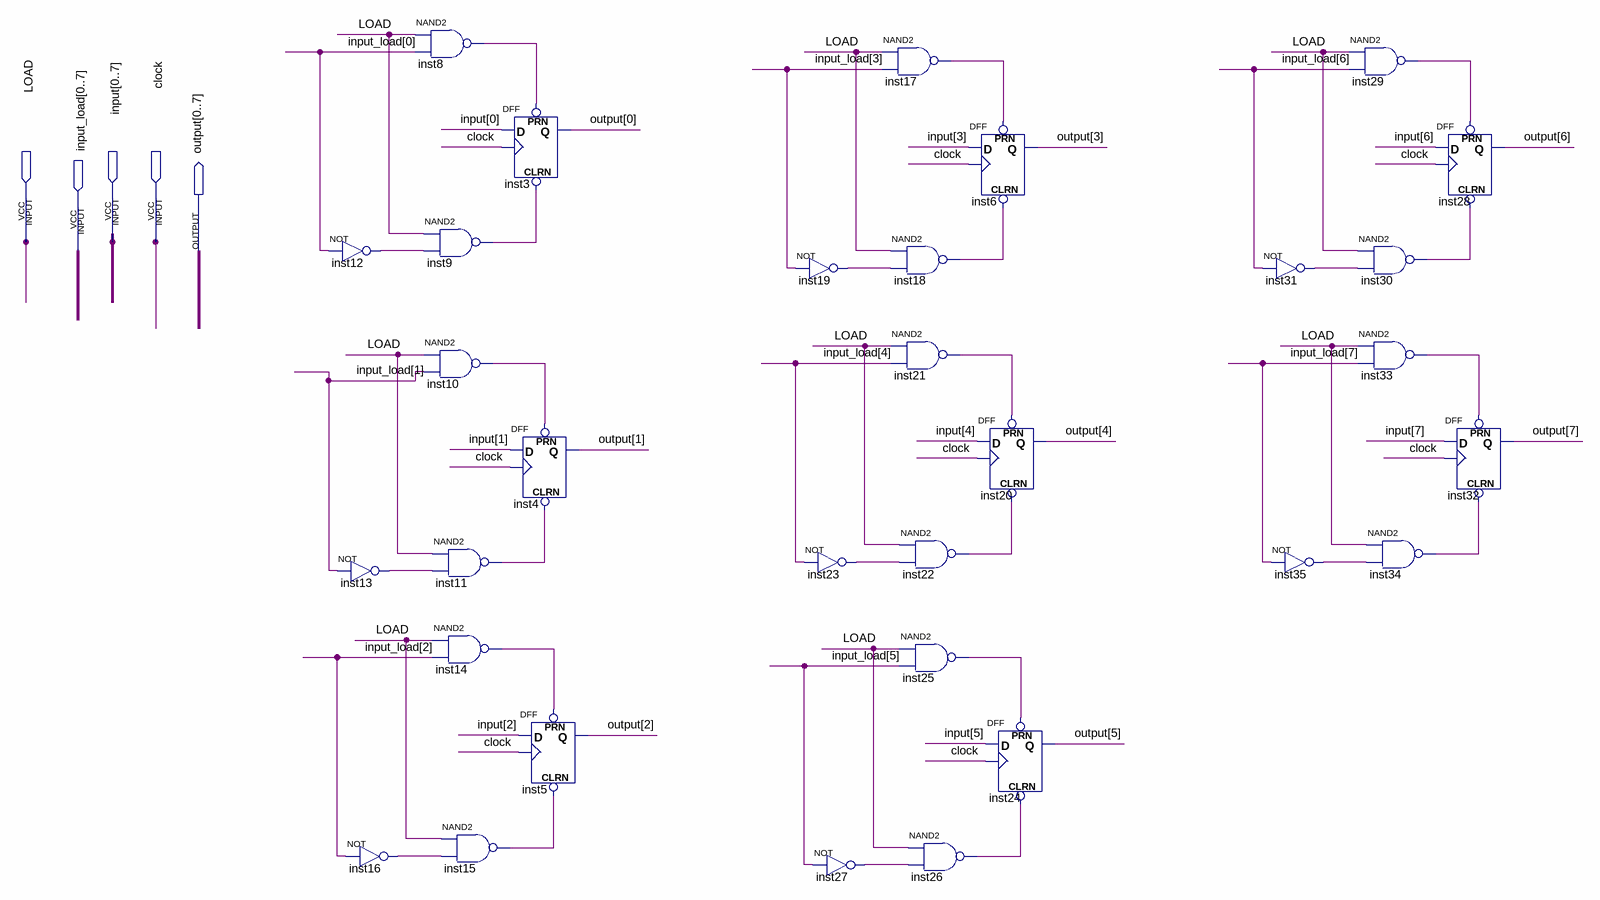
[diagram p0: schematic sheet]
// Quartus schematic REGISTER_8BIT.bdf as structural Verilog: 32 symbols, 5 pins
module REGISTER_8BIT (
  input  LOAD,
  input  [0:7] \input ,
  input  clock,
  input  [0:7] input_load,
  output [0:7] \output 
);

  wire inst8_out, inst9_out, inst10_out, inst11_out, inst12_out, inst13_out, inst14_out, inst15_out,
       inst16_out, inst17_out, inst18_out, inst19_out, inst21_out, inst22_out, inst23_out, inst25_out,
       inst26_out, inst27_out, inst29_out, inst30_out, inst31_out, inst33_out, inst34_out, inst35_out;

  not inst12 (inst12_out, input_load[0]);
  not inst13 (inst13_out, input_load[1]);
  not inst16 (inst16_out, input_load[2]);
  nand inst8 (inst8_out, LOAD, input_load[0]);
  nand inst9 (inst9_out, LOAD, inst12_out);
  nand inst10 (inst10_out, LOAD, input_load[1]);
  nand inst11 (inst11_out, LOAD, inst13_out);
  nand inst14 (inst14_out, LOAD, input_load[2]);
  nand inst15 (inst15_out, LOAD, inst16_out);
  DFF inst3 (.CLRN(inst9_out), .CLK(clock), .D(\input [0]), .PRN(inst8_out), .Q(\output [0]));
  DFF inst4 (.CLRN(inst11_out), .CLK(clock), .D(\input [1]), .PRN(inst10_out), .Q(\output [1]));
  DFF inst5 (.CLRN(inst15_out), .CLK(clock), .D(\input [2]), .PRN(inst14_out), .Q(\output [2]));
  not inst19 (inst19_out, input_load[3]);
  not inst23 (inst23_out, input_load[4]);
  not inst27 (inst27_out, input_load[5]);
  nand inst17 (inst17_out, LOAD, input_load[3]);
  nand inst18 (inst18_out, LOAD, inst19_out);
  nand inst21 (inst21_out, LOAD, input_load[4]);
  nand inst22 (inst22_out, LOAD, inst23_out);
  nand inst25 (inst25_out, LOAD, input_load[5]);
  DFF inst6 (.CLRN(inst18_out), .CLK(clock), .D(\input [3]), .PRN(inst17_out), .Q(\output [3]));
  nand inst26 (inst26_out, LOAD, inst27_out);
  DFF inst20 (.CLRN(inst22_out), .CLK(clock), .D(\input [4]), .PRN(inst21_out), .Q(\output [4]));
  DFF inst24 (.CLRN(inst26_out), .CLK(clock), .D(\input [5]), .PRN(inst25_out), .Q(\output [5]));
  not inst31 (inst31_out, input_load[6]);
  not inst35 (inst35_out, input_load[7]);
  nand inst29 (inst29_out, LOAD, input_load[6]);
  nand inst30 (inst30_out, LOAD, inst31_out);
  nand inst33 (inst33_out, LOAD, input_load[7]);
  nand inst34 (inst34_out, LOAD, inst35_out);
  DFF inst28 (.CLRN(inst30_out), .CLK(clock), .D(\input [6]), .PRN(inst29_out), .Q(\output [6]));
  DFF inst32 (.CLRN(inst34_out), .CLK(clock), .D(\input [7]), .PRN(inst33_out), .Q(\output [7]));
endmodule
